# Altium schematic sheet AnalogIn.SchDoc
size A4; SheetNumber: 1; SheetTotal: 3
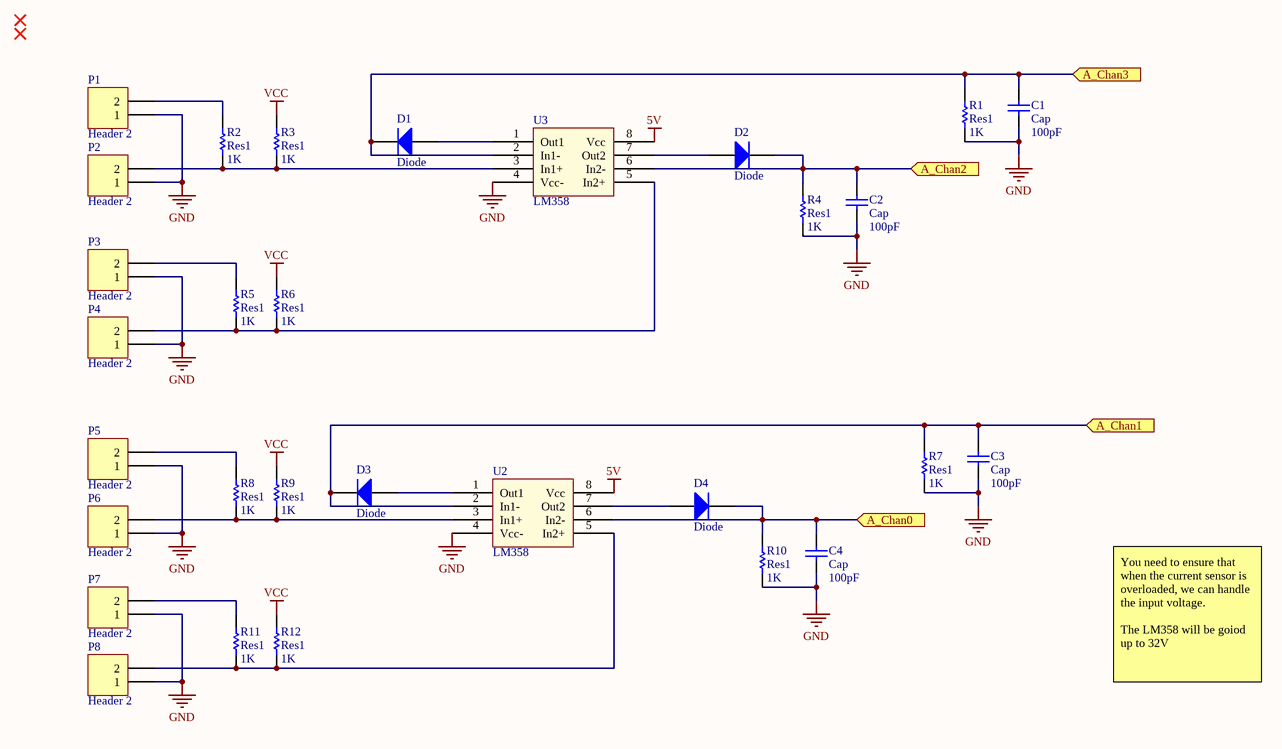
[diagram p0: AnalogIn.SchDoc]

## Parts
C1  Cap  value 100pF  [CAPC2012X04M]
C2  Cap  value 100pF  [CAPC2012X04M]
C3  Cap  value 100pF  [CAPC2012X04M]
C4  Cap  value 100pF  [CAPC2012X04M]
D1  Diode  [DIOC2012X04M]
D2  Diode  [DIOC2012X04M]
D3  Diode  [DIOC2012X04M]
D4  Diode  [DIOC2012X04M]
P1  Header 2  [HDR1X2]
P2  Header 2  [WURTH- WR-TBL 2pin 5mmpitch]
P3  Header 2  [HDR1X2]
P4  Header 2  [WURTH- WR-TBL 2pin 5mmpitch]
P5  Header 2  [HDR1X2]
P6  Header 2  [WURTH- WR-TBL 2pin 5mmpitch]
P7  Header 2  [HDR1X2]
P8  Header 2  [WURTH- WR-TBL 2pin 5mmpitch]
R1  Res1  value 1K  [RESC2012X04M]
R2  Res1  value 1K  [RESC2012X04M]
R3  Res1  value 1K  [RESC2012X04M]
R4  Res1  value 1K  [RESC2012X04M]
R5  Res1  value 1K  [RESC2012X04M]
R6  Res1  value 1K  [RESC2012X04M]
R7  Res1  value 1K  [RESC2012X04M]
R8  Res1  value 1K  [RESC2012X04M]
R9  Res1  value 1K  [RESC2012X04M]
R10  Res1  value 1K  [RESC2012X04M]
R11  Res1  value 1K  [RESC2012X04M]
R12  Res1  value 1K  [RESC2012X04M]
U2  LM358  [SOIC127P600X155-8N]
U3  LM358  [SOIC127P600X155-8N]

## Ports
A_Chan0 (in), A_Chan1 (in), A_Chan2 (in), A_Chan3 (in)

## Nets
5V: U2.8(Vcc) U3.8(Vcc)
GND: C1.1 C2.1 C3.1 C4.1 P1.1 P2.1 P3.1 P4.1 P5.1 P6.1 P7.1 P8.1 R1.1 R4.1 R7.1 R10.1 U2.4(Vcc-) U3.4(Vcc-)
VCC: R3.1 R6.1 R9.1 R12.1
A_Chan0: C4.2 D4.2(K) R10.2 U2.6(In2-) ; port A_Chan0
A_Chan1: C3.2 D3.2(K) R7.2 U2.2(In1-) ; port A_Chan1
A_Chan2: C2.2 D2.2(K) R4.2 U3.6(In2-) ; port A_Chan2
A_Chan3: C1.2 D1.2(K) R1.2 U3.2(In1-) ; port A_Chan3
NetD1_1: D1.1(A) U3.1(Out1)
NetD2_1: D2.1(A) U3.7(Out2)
NetD3_1: D3.1(A) U2.1(Out1)
NetD4_1: D4.1(A) U2.7(Out2)
NetP1_2: P1.2 R2.1
NetP2_2: P2.2 R2.2 R3.2 U3.3(In1+)
NetP3_2: P3.2 R5.1
NetP4_2: P4.2 R5.2 R6.2 U3.5(In2+)
NetP5_2: P5.2 R8.1
NetP6_2: P6.2 R8.2 R9.2 U2.3(In1+)
NetP7_2: P7.2 R11.1
NetP8_2: P8.2 R11.2 R12.2 U2.5(In2+)

## Notes on the sheet
- You need to ensure that when the current sensor is overloaded, we can handle the input voltage.
  The LM358 will be goiod up to 32V

## Library data of the parts
C1-C4 = Cap: Capacitor; Published: 8-Jun-2000; LatestRevisionDate: 17-Jul-2002; LatestRevisionNote: Re-released for DXP Platform.; PackageReference: RAD-0.3; Publisher: Altium Limited; PackageDescription: Radial Cap, Thru-Hole; 2 Leads; 0.3 in Pin Spacing
D1-D4 = Diode: Default Diode; Published: 8-Jun-2000; LatestRevisionDate: 17-Jul-2002; LatestRevisionNote: Re-released for DXP Platform.; PackageVersion: Sep-1996; PackageReference: SMC; Publisher: Altium Limited; PackageDescription: DO-214-AB/SMC; 2 C-Bend Leads; Body 7.9 x 5.9 mm, inc. leads (LxW); Code_JEDEC: DO-214-AB
P1-P8 = Header 2: Header, 2-Pin; LatestRevisionDate: 17-Jul-2002; LatestRevisionNote: Re-released for DXP Platform.; Publisher: Altium Limited
R1-R12 = Res1: Resistor; Published: 8-Jun-2000; LatestRevisionDate: 17-Jul-2002; LatestRevisionNote: Re-released for DXP Platform.; PackageReference: AXIAL-0.3; Publisher: Altium Limited; PackageDescription: Axial Device, Thru-Hole; 2 Leads; 0.3 in Pin Spacing